# EAGLE schematic StationModule (EAGLE 7.2.0)
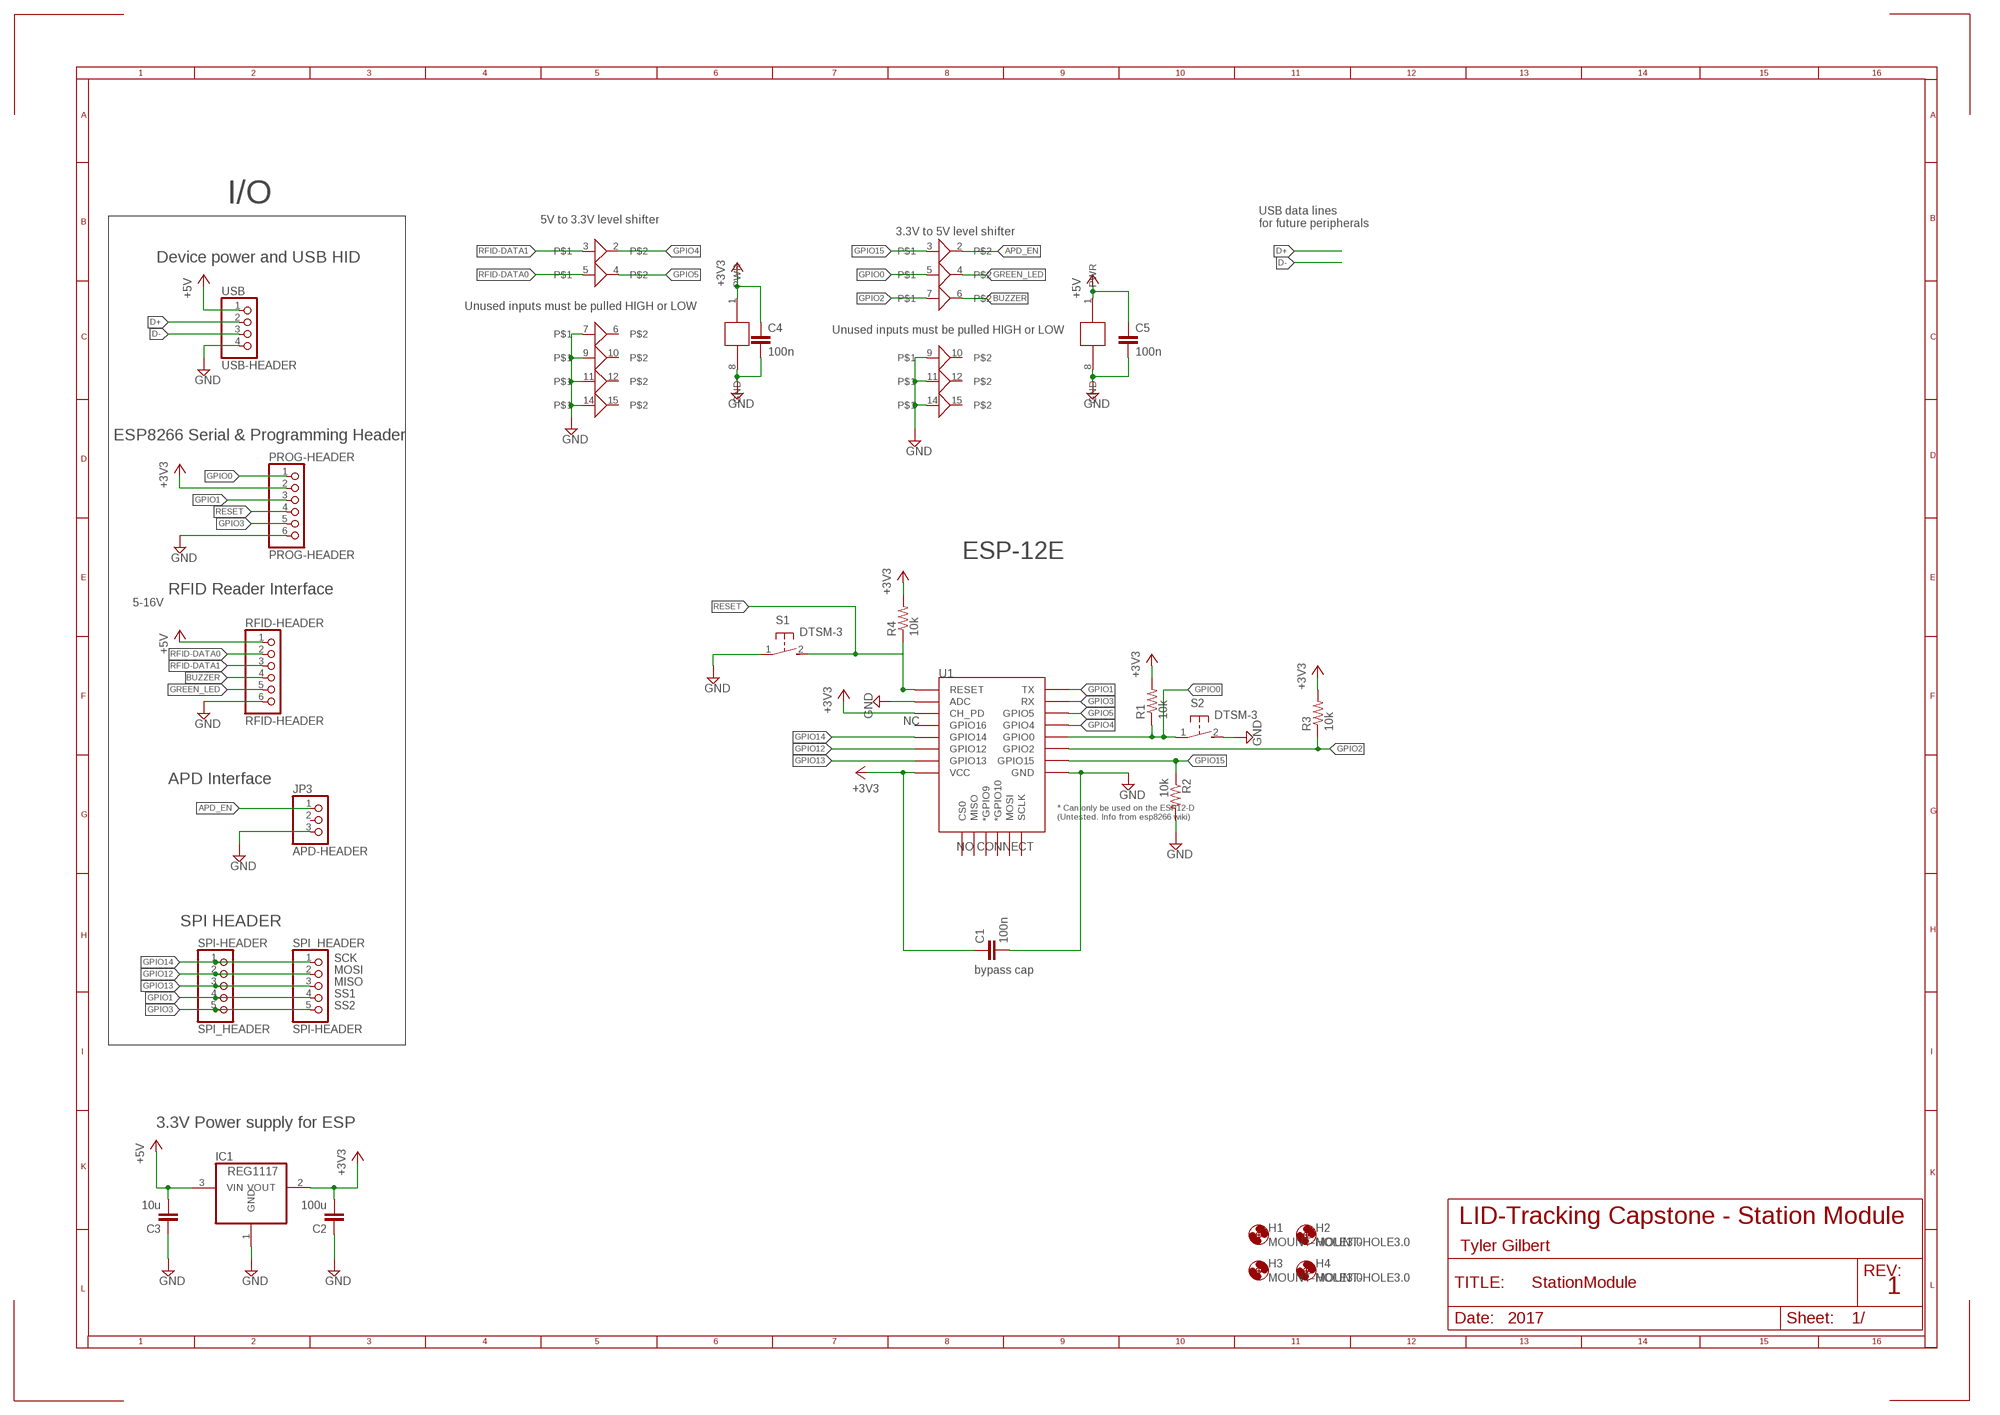
[diagram p0: schematic, sheet 1]

## Parts
C1  100n  C-EUC0805K  [C0805K]
C2  100u  C-EUC0805K  [C0805K]
C3  10u  C-EUC0805K  [C0805K]
C4  100n  C-EUC0805K  [C0805K]
C5  100n  C-EUC0805K  [C0805K]
H1  MOUNT-HOLE3.0  [3,0]
H2  MOUNT-HOLE3.0  [3,0]
H3  MOUNT-HOLE3.0  [3,0]
H4  MOUNT-HOLE3.0  [3,0]
IC1  REG1117  [SOT223]
JP3  APD-HEADER  PINHD-1X3  [1X03]
PROG-HEADER  PROG-HEADER  PINHD-1X6  [1X06]
R1  10k  R-US_R0805  [R0805]
R2  10k  R-US_R0805  [R0805]
R3  10k  R-US_R0805  [R0805]
R4  10k  R-US_R0805  [R0805]
RFID-HEADER  RFID-HEADER  PINHD-1X6  [1X06]
S1  DTSM-3  [DTSM-3]
S2  DTSM-3  [DTSM-3]
SPI-HEADER  SPI_HEADER  PINHD-1X5  [1X05]
SPI_HEADER  SPI-HEADER  PINHD-1X5  [1X05]
U1  ESP12ESMD  [ESP12E-SMD]
U$1  4050B  [SOIC16N]
U$2  4050B  [SOIC16N]
USB  USB-HEADER  PINHD-1X4  [1X04]

## Nets
+3V3: C1.1 C2.2 C4.1 IC1.2(VOUT) PROG-HEADER.2 R1.2 R3.2 R4.2 U1.CH_PD U1.VCC U$1.1(PWR)
+5V: C3.2 C5.1 IC1.3(VIN) RFID-HEADER.1 U$2.1(PWR) USB.1
APD_EN: JP3.1 U$2.2
BUZZER: RFID-HEADER.4 U$2.6
D+: USB.2
D-: USB.3
GND: C1.2 C2.1 C3.1 C4.2 C5.2 IC1.1(GND) JP3.3 PROG-HEADER.6 R2.2 RFID-HEADER.6 S1.1 S2.2 U1.ADC U1.GND U$1.7 U$1.8(GND) U$1.9 U$1.11 U$1.14 U$2.8(GND) U$2.9 U$2.11 U$2.14 USB.4
GPIO0: PROG-HEADER.1 R1.1 S2.1 U1.GPIO0 U$2.5
GPIO1: PROG-HEADER.3 SPI-HEADER.4 SPI_HEADER.4 U1.TXD0(TX)
GPIO2: R3.1 U1.GPIO2 U$2.7
GPIO3: PROG-HEADER.5 SPI-HEADER.5 SPI_HEADER.5 U1.RXD0(RX)
GPIO4: U1.GPIO4 U$1.2
GPIO5: U1.GPIO5 U$1.4
GPIO12: SPI-HEADER.2 SPI_HEADER.2 U1.GPIO12
GPIO13: SPI-HEADER.3 SPI_HEADER.3 U1.GPIO13
GPIO14: SPI-HEADER.1 SPI_HEADER.1 U1.GPIO14
GPIO15: R2.1 U1.GPIO15 U$2.3
GREEN_LED: RFID-HEADER.5 U$2.4
RESET: PROG-HEADER.4 R4.1 S1.2 U1.RESET
RFID-DATA0: RFID-HEADER.2 U$1.5
RFID-DATA1: RFID-HEADER.3 U$1.3
Unconnected: JP3.2 U1.CS0 U1.GPIO9(*GPIO9) U1.GPIO10(*GPIO10) U1.GPIO16 U1.MISO U1.MOSI U1.SCLK U$1.6 U$1.10 U$1.12 U$1.15 U$2.10 U$2.12 U$2.15

## Notes on the sheet
- I/O
- 5V to 3.3V level shifter
- USB data lines
  for future peripherals
- 3.3V to 5V level shifter
- Device power and USB HID
- Unused inputs must be pulled HIGH or LOW
- Unused inputs must be pulled HIGH or LOW
- ESP8266 Serial & Programming Header
- ESP-12E
- RFID Reader Interface
- 5-16V
- NC
- APD Interface
- NO CONNECT
- SPI HEADER
- SCK
- MOSI | bypass cap
- MISO
- SS1
- SS2
- 3.3V Power supply for ESP

## Library data of the parts
C1-C5 = rcl:C-EU: CAPACITOR, European symbol
H1-H4 = holes:MOUNT-HOLE: MOUNTING HOLE with drill center marker
IC1 = burr-brown:REG1117: 800mA and 1A Low Dropout (LDO) Positive Regulator 1.8V, 2.5V, 2.85V, 3.3V, 5V, and Adj; MPN: REG1117; OC_FARNELL: 1097566; OC_NEWARK: 14P6981
JP3 = pinhead:PINHD-1X3: PIN HEADER
PROG-HEADER RFID-HEADER = pinhead+:PINHD-1X6: PIN HEADER
R1-R4 = rcl:R-US_: RESISTOR, American symbol
S1 S2 = switch-tact:DTSM-3
SPI-HEADER SPI_HEADER = pinhead+:PINHD-1X5: PIN HEADER
U1 = esp8266modules:ESP12E: ESP12E Module
U$1 U$2 = Ty2017:4050B
USB = pinhead+:PINHD-1X4: PIN HEADER